# Altium schematic sheet RelayDetect2 V2.SchDoc
size A4
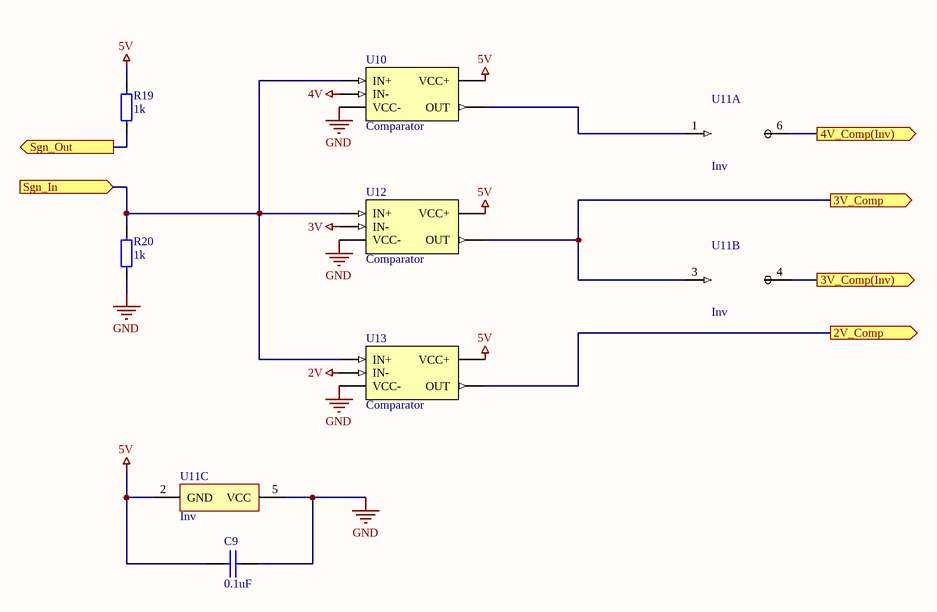
[diagram p0: RelayDetect2 V2.SchDoc]

## Parts
C9  0.1uF  [0805 Capicator]
R19  1k  [0603 Resistor]
R20  1k  [0603 Resistor]
U10  Comparator  [SOT-23-5]
U11  Inv  [SOT236]  (parts A,B,C of 3)
U12  Comparator  [SOT-23-5]
U13  Comparator  [SOT-23-5]

## Ports
2V_Comp (out), 3V_Comp (out), 3V_Comp(Inv) (out), 4V_Comp(Inv) (out), Sgn_In (in), Sgn_Out (out)

## Nets
2V: U13.4(IN-)
3V: U12.4(IN-)
4V: U10.4(IN-)
5V: C9.1 R19.2 U10.5(VCC+) U11.2(GND) U12.5(VCC+) U13.5(VCC+)
GND: C9.2 R20.1 U10.2(VCC-) U11.5(VCC) U12.2(VCC-) U13.2(VCC-)
2V_Comp: U13.1(OUT) ; port 2V_Comp
3V_Comp: U11.3(A) U12.1(OUT) ; port 3V_Comp
3V_Comp(Inv): U11.4(Y) ; port 3V_Comp(Inv)
4V_Comp(Inv): U11.6(Y) ; port 4V_Comp(Inv)
Sgn_In: R20.2 U10.3(IN+) U12.3(IN+) U13.3(IN+) ; port Sgn_In
Sgn_Out: R19.1 ; port Sgn_Out
NetU10_1: U10.1(OUT) U11.1(A)

## Notes on the sheet
- Size:
- Date:
- A4
- Car#:
- Time:
- 418
- Team:
- Sheet
- BRT
- of
- University:
- Technical University
- Bauman Moscow State
- Document Version:

## Library data of the parts
C9 = Cap 0.1uF (0805): 0.1uF X7R 50V 10% 0805; Manufacturer: Murata Manufacturing; Part Number: GRM21BR71E104KA01L; Type: Capacitor; ComponentLink1Description: Chip&Dip; ComponentLink1URL: https://www.chipdip.ru/product/grm21br71e104ka01l
R19 R20 = Res 1k (0603): 0.1W 0603 1k, 1%; Part Number: RC0603FR-071KL; Manufacturer: Taiwan; Type: Resistor; ComponentLink1Description: Chip&Dip; ComponentLink1URL: https://www.chipdip.ru/product0/9000079676
U10 U12 U13 = Comparator [LMV]: LMV7219 7-ns 2.7-V to 5-V Comparator with Rail-to-Rail Output; Part Number: LMV7219M5X/NOPB; Manufacturer: Texas Instruments; ComponentLink1Description: DataSheet; ComponentLink1URL: http://www.ti.com/lit/ds/symlink/lmv7219.pdf; ComponentLink2Description: Mouser; ComponentLink2URL: https://ru.mouser.com/ProductDetail/Texas-Instruments/LMV7219M5X-NOPB?qs=sGAEpiMZZMuayl%2FEk2kXcbEcxwmoPguctVQUIBgrLJY%3D; Type: IC
U11 = Inverter: Chip&Dip: https://www.chipdip.ru/product/sn74lvc2g04dbvr-2